# Altium project Digital Lock.PrjPcb
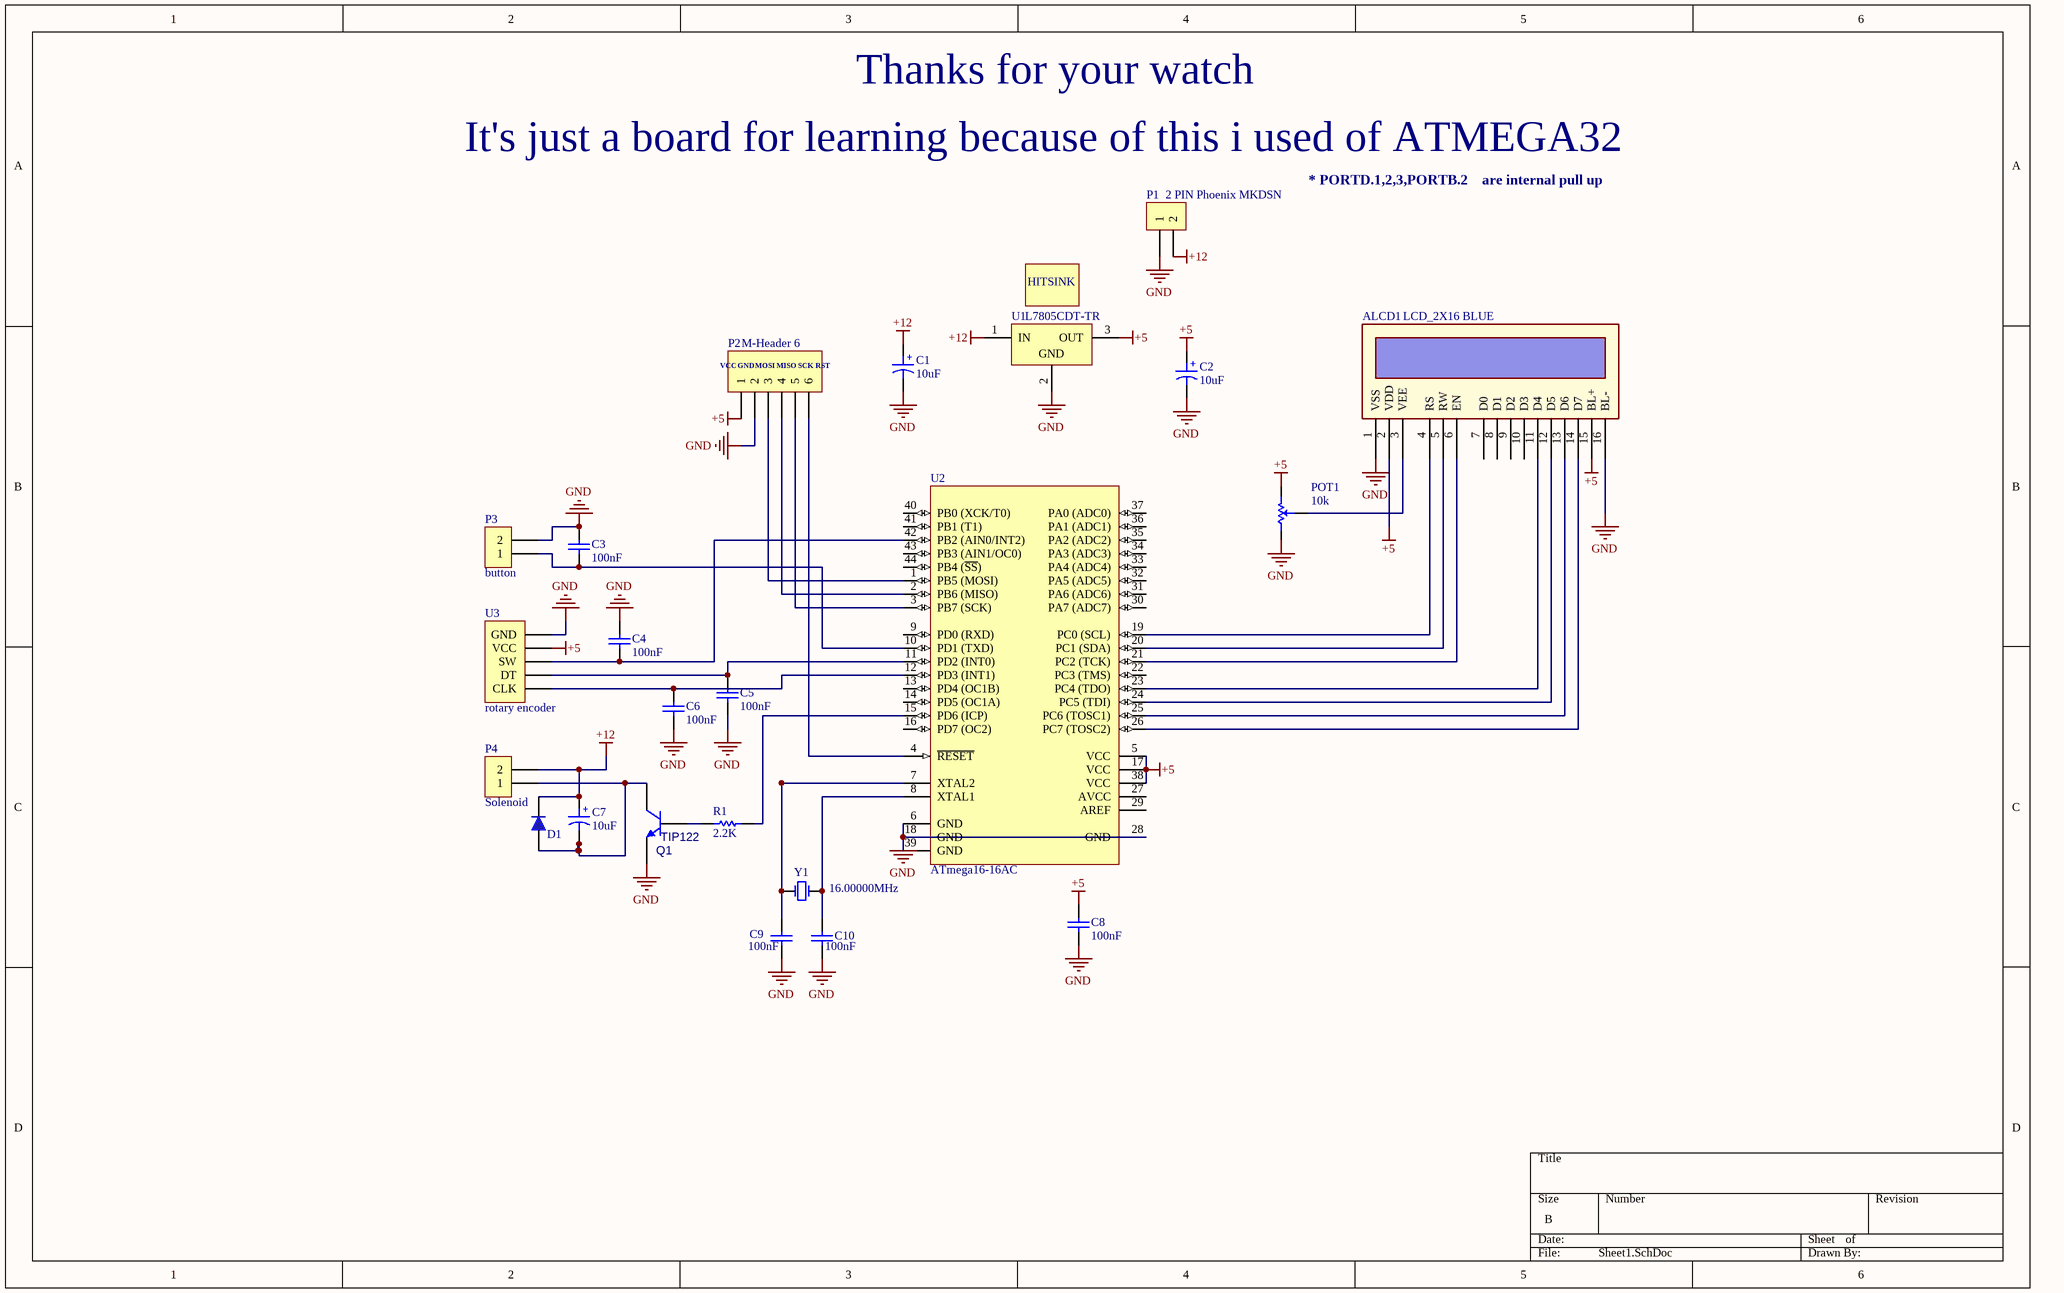
[diagram p0: Sheet1.SchDoc]
1 sheet, 24 parts. Net scope: global (net labels, ports and power ports of the same name join across sheets).
Board file: PCB1.PcbDoc

## Sheet Sheet1.SchDoc
size B; SheetNumber: 1; SheetTotal: 1

### Parts
1  Hitsink  [HITSINK 1]  (value not drawn)
ALCD1  LCD_2X16 BLUE  [LCD_2X16 BLUE]
C1  10uF  [Cap 6.3x12-2.5]
C2  10uF  [Cap 6.3x12-2.5]
C3  100nF  [CAP1206]
C4  100nF  [CAP1206]
C5  100nF  [CAP1206]
C6  100nF  [CAP1206]
C7  10uF  [Cap 5x12-2]
C8  100nF  [CAP1206]
C9  100nF  [CAP1206]
C10  100nF  [CAP1206]
D1  1n4007  [Diode 1N4007 SMD]  (value not drawn)
P1  2 PIN Phoenix MKDSN  [2 PIN Phoenix MKDSN]
P2  M-Header 6  [M-Header 6]
P3  button  [2 PIN Phoenix MKDSN]
P4  Solenoid  [2 PIN Phoenix MKDSN]
POT1  10k  [POT MULTITURN]
Q1  TIP122  [TIP122]
R1  2.2K  [RES1206]
U1  L7805CDT-TR  [TO-263]
U2  ATmega16-16AC  [44A]
U3  rotary encoder  [rotary encoder]
Y1  16.00000MHz  [CRYSTAL Small]

### Nets
+5: ALCD1.2(VDD) ALCD1.15(BL+) C2.1 C8.2 P2.1 POT1.2(CW) U1.3(OUT) U2.5(VCC) U2.17(VCC) U2.38(VCC) U3.4(VCC)
+12: C1.1 C7.1 D1.2 P1.2 P4.2 U1.1(IN)
GND: ALCD1.1(VSS) ALCD1.16(BL-) C1.2 C2.2 C3.2 C4.2 C5.1 C6.1 C8.1 C9.1 C10.1 P1.1 P2.2 P3.2 POT1.1(CCW) Q1.3(E) U1.2(GND) U2.6(GND) U2.18(GND) U2.28(GND) U2.39(GND) U3.5(GND)
NetALCD1_3: ALCD1.3(VEE) POT1.3(SetPoint)
NetALCD1_4: ALCD1.4(RS) U2.19(PC0_(SCL))
NetALCD1_5: ALCD1.5(RW) U2.20(PC1_(SDA))
NetALCD1_6: ALCD1.6(EN) U2.21(PC2_(TCK))
NetALCD1_11: ALCD1.11(D4) U2.23(PC4_(TDO))
NetALCD1_12: ALCD1.12(D5) U2.24(PC5_(TDI))
NetALCD1_13: ALCD1.13(D6) U2.25(PC6_(TOSC1))
NetALCD1_14: ALCD1.14(D7) U2.26(PC7_(TOSC2))
NetC3_1: C3.1 P3.1 U2.10(PD1_(TXD))
NetC4_1: C4.1 U2.42(PB2_(AIN0/INT2)) U3.3(SW)
NetC5_2: C5.2 U2.11(PD2_(INT0)) U3.2(DT)
NetC6_2: C6.2 U2.12(PD3_(INT1)) U3.1(CLK)
NetC7_2: C7.2 D1.1 P4.1 Q1.2(C)
NetC9_2: C9.2 U2.7(XTAL2) Y1.2(OSC2)
NetC10_2: C10.2 U2.8(XTAL1) Y1.1(OSC1)
NetP2_3: P2.3 U2.1(PB5_(MOSI))
NetP2_4: P2.4 U2.2(PB6_(MISO))
NetP2_5: P2.5 U2.3(PB7_(SCK))
NetP2_6: P2.6 U2.4(~{RESET})
NetQ1_1: Q1.1(B) R1.1
NetR1_2: R1.2 U2.15(PD6_(ICP))

Not connected (* = marked no-connect by the designer): ALCD1 7(D0) 8(D1) 9(D2) 10(D3); U2 9(PD0_(RXD)) 13(PD4_(OC1B)) 14(PD5_(OC1A)) 16(PD7_(OC2)) 22(PC3_(TMS)) 27(AVCC) 29(AREF) 30(PA7_(ADC7)) 31(PA6_(ADC6)) 32(PA5_(ADC5)) 33(PA4_(ADC4)) 34(PA3_(ADC3)) 35(PA2_(ADC2)) 36(PA1_(ADC1)) 37(PA0_(ADC0)) 40(PB0_(XCK/T0)) 41(PB1_(T1)) 43(PB3_(AIN1/OC0)) 44(PB4_(~{SS}))

### Notes on the sheet
- Thanks for your watch
- It's just a board for learning because of this i used of ATMEGA32
- * PORTD.1,2,3,PORTB.2    are internal pull up
- (near P2) VCC
- (near P2) GND
- (near P2) MOSI
- (near P2) MISO
- (near P2) SCK
- (near P2) RST
- (in symbol Capacitor DIP) +
- (in symbol Hitsink) HITSINK

### Library data of the parts
C1 C2 C7 = Capacitor DIP
C3-C6 C8-C10 = Capacitor SMD
D1 = Diode 1n4007
P3 P4 = 2 PIN Phoenix MKDSN
POT1 = Potentiometer
R1 = Resistor SMD
U2 = ATmega16-16AC: 8-Bit AVR Microcontroller with 16K Bytes of In-System Programmable Flash Memory; Package Information: Latest Revision: 1995; Published: 17-Sep-2003; Revision: 17-Dec-2003: PCB Footprint updated; Datasheet: Latest Revision: 2466E-AVR-10/02; Package Reference: 44A; Publisher: Altium Limited
Y1 = XTAL DIP